# Altium schematic sheet wifi.SchDoc
size A4
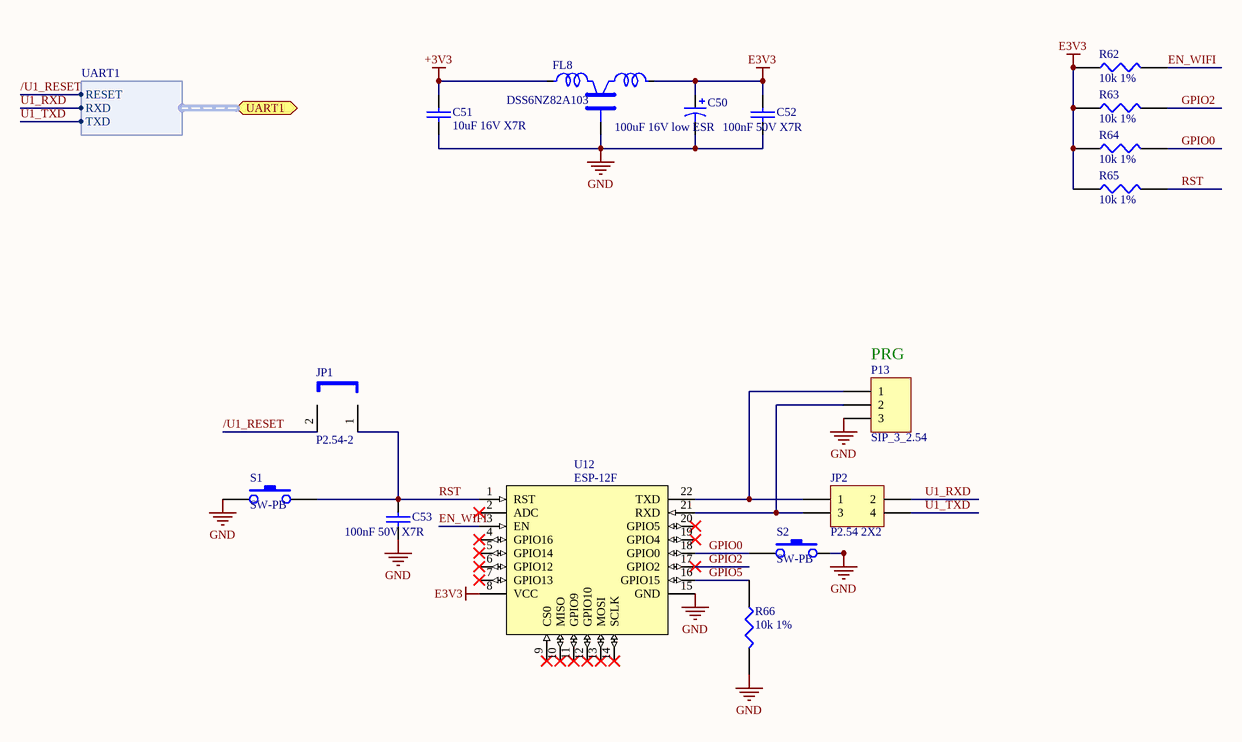
[diagram p0: wifi.SchDoc]

## Parts
C50  100uF 16V low ESR  [CAPPR2-5x11]
C51  10uF 16V X7R  [CAPC3216N]
C52  100nF 50V X7R  [CAPC2012N]
C53  100nF 50V X7R  [CAPC2012N]
FL8  DSS6NZ82A103  [DSS6]
JP1  P2.54-2  [JP2-P2.54]
JP2  P2.54 2X2  [HDR2X2]
P13  SIP_3_2.54  [REAL_SIP3_2.54]  (no BOM)
R62  10k 1%  [RESC2012N]
R63  10k 1%  [RESC2012N]
R64  10k 1%  [RESC2012N]
R65  10k 1%  [RESC2012N]
R66  10k 1%  [RESC2012N]
S1  SW-PB  [SW5X7]  (no BOM)
S2  SW-PB  [SW5X7]  (no BOM)
U12  ESP-12F  [ESP-12F]

## Ports
UART1 (harness UART1)

## Harnesses
UART1: TXD, RXD, RESET

## Nets
+3V3: C51.1 FL8.1
E3V3: C50.1 C52.1 FL8.3 R62.1 R63.1 R64.1 R65.1 U12.8(VCC)
GND: C50.2 C51.2 C52.2 C53.2 FL8.2 P13.3 R66.2 S1.1 S2.2 U12.15(GND)
/U1_RESET: JP1.2 ; port UART1.RESET
EN_WIFI: R62.2 U12.3(EN)
GPIO0: R64.2 S2.1 U12.18(GPIO0)
GPIO2: R63.2 U12.17(GPIO2)
GPIO5: R66.1 U12.16(GPIO15)
RST: C53.1 JP1.1 R65.2 S1.2 U12.1(RST)
U1_RXD: JP2.2 ; port UART1.RXD
U1_TXD: JP2.4 ; port UART1.TXD
NetJP2_1: JP2.1 P13.1 U12.22(TXD)
NetJP2_3: JP2.3 P13.2 U12.21(RXD)

Not connected (* = marked no-connect by the designer): U12 2(ADC)* 4(GPIO16)* 5(GPIO14)* 6(GPIO12)* 7(GPIO13)* 9(CS0)* 10(MISO)* 11(GPIO9)* 12(GPIO10)* 13(MOSI)* 14(SCLK)* 19(GPIO4)* 20(GPIO5)*

## Notes on the sheet
- (near P13) PRG

## Library data of the parts
C50 = Cap Pol1: Polarized Capacitor (Radial); Price: 0.38
C51-C53 = CAP: Price: 0.025
FL8 = DSS6: Murata EMI suppression filter; Manufacturer: Murata; Price: 0.5
JP1 = JUMPER
JP2 = Header 2X2: Jumper 2.54 2-Pin, Dual row; LatestRevisionDate: 17-Jul-2002; LatestRevisionNote: Re-released for DXP Platform.; Publisher: Altium Limited
P13 = Header 3: Header, 3-Pin; LatestRevisionDate: 17-Jul-2002; LatestRevisionNote: Re-released for DXP Platform.; Publisher: Altium Limited
R62-R66 = RES1
U12 = ESP-12F: Wi-Fi module; Manufacturer: Ai-Thinker; Price: 11.8